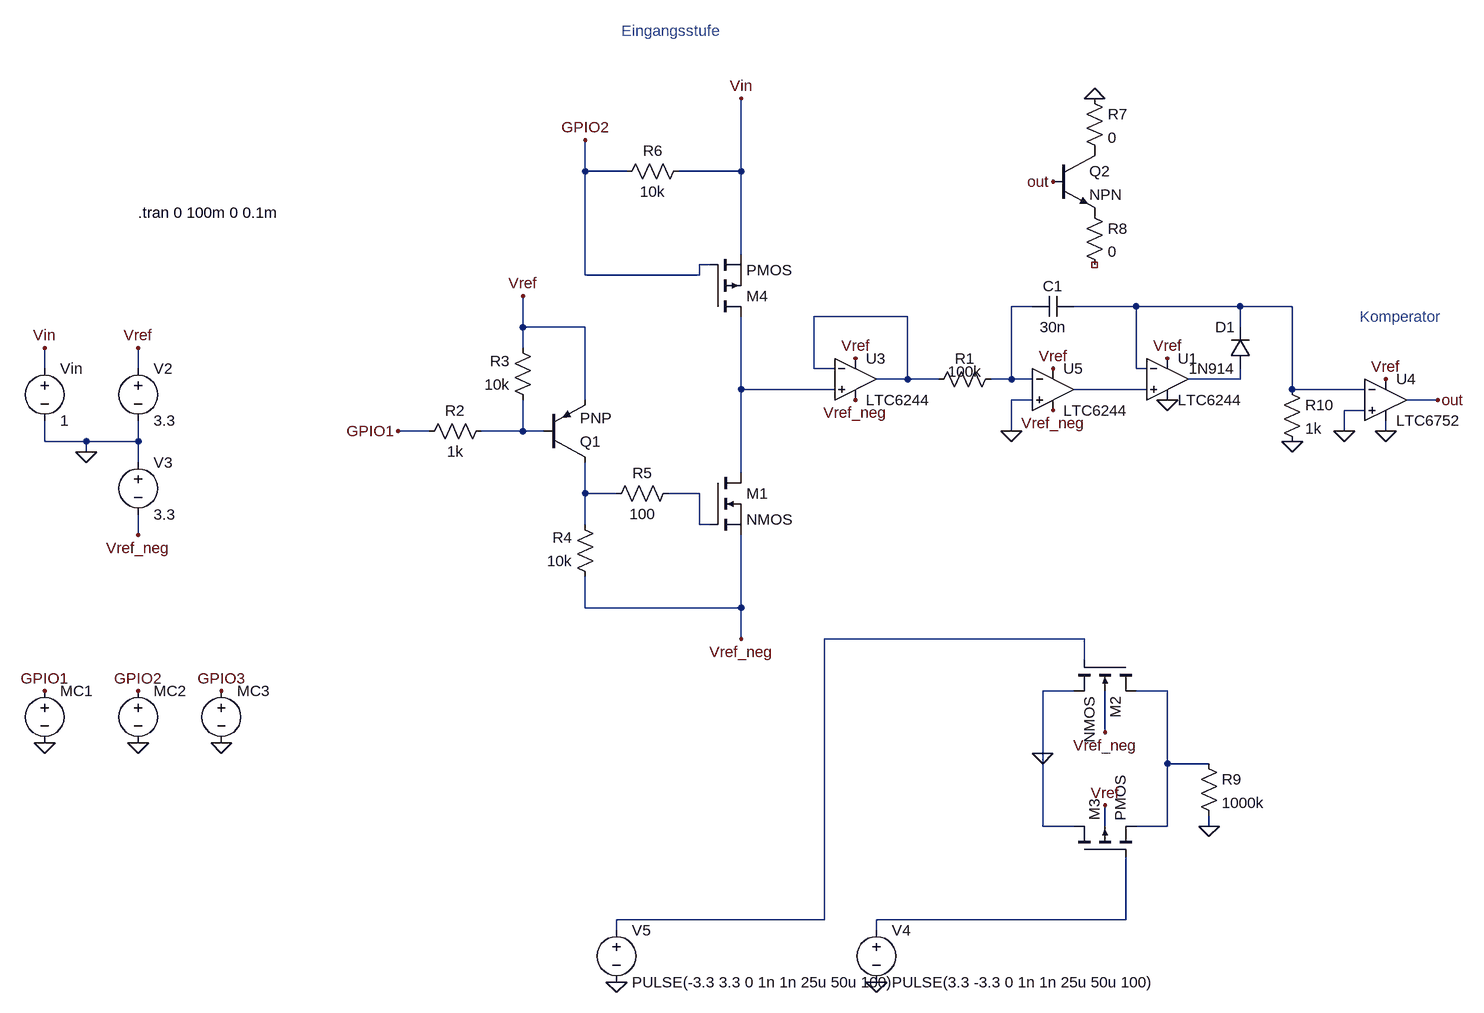
[diagram p0: schematic dual_slope_adc.asc]
dual_slope_adc.asc, the LTspice schematic file:
Version 4
SHEET 1 1108 1332
WIRE -304 -320 -304 -368
WIRE -240 -320 -304 -320
WIRE -64 -320 -64 -432
WIRE -64 -320 -160 -320
WIRE -64 -192 -64 -320
WIRE -112 -176 -128 -176
WIRE -304 -160 -304 -320
WIRE -128 -160 -128 -176
WIRE -128 -160 -304 -160
WIRE 384 -112 352 -112
WIRE 544 -112 448 -112
WIRE 704 -112 544 -112
WIRE 784 -112 704 -112
WIRE 192 -96 48 -96
WIRE -400 -80 -400 -128
WIRE -304 -80 -400 -80
WIRE 704 -80 704 -112
WIRE -400 -48 -400 -80
WIRE -1136 -16 -1136 -48
WIRE -992 -16 -992 -48
WIRE 48 -16 48 -96
WIRE 80 -16 48 -16
WIRE 544 -16 544 -112
WIRE 560 -16 544 -16
WIRE 192 0 192 -96
WIRE 192 0 144 0
WIRE 240 0 192 0
WIRE 352 0 352 -112
WIRE 352 0 320 0
WIRE 384 0 352 0
WIRE 704 0 704 -16
WIRE 704 0 624 0
WIRE -64 16 -64 -96
WIRE 80 16 -64 16
WIRE 560 16 448 16
WIRE 784 16 784 -112
WIRE 896 16 784 16
WIRE -304 32 -304 -80
WIRE 384 32 352 32
WIRE 1008 32 960 32
WIRE 896 48 864 48
WIRE -544 80 -592 80
WIRE -400 80 -400 32
WIRE -400 80 -464 80
WIRE -368 80 -400 80
WIRE 352 80 352 32
WIRE 864 80 864 48
WIRE 928 80 928 64
WIRE -1136 96 -1136 64
WIRE -1072 96 -1136 96
WIRE -992 96 -992 64
WIRE -992 96 -1072 96
WIRE -1072 112 -1072 96
WIRE -992 128 -992 96
WIRE -64 144 -64 16
WIRE -304 176 -304 128
WIRE -256 176 -304 176
WIRE -128 176 -176 176
WIRE -304 224 -304 176
WIRE -128 224 -128 176
WIRE -112 224 -128 224
WIRE -992 240 -992 208
WIRE -304 352 -304 304
WIRE -64 352 -64 240
WIRE -64 352 -304 352
WIRE -64 400 -64 352
WIRE 464 400 64 400
WIRE 464 432 464 400
WIRE 448 480 400 480
WIRE 592 480 544 480
WIRE 496 544 496 480
WIRE 400 576 400 480
WIRE 592 592 592 480
WIRE 656 592 592 592
WIRE 400 688 400 576
WIRE 448 688 400 688
WIRE 496 688 496 656
WIRE 592 688 592 592
WIRE 592 688 544 688
WIRE 656 688 656 672
WIRE 64 832 64 400
WIRE 64 832 -256 832
WIRE 528 832 528 736
WIRE 528 832 144 832
WIRE -256 848 -256 832
WIRE 144 848 144 832
FLAG -1072 112 0
FLAG 352 80 0
FLAG 864 80 0
FLAG 928 80 0
FLAG -1136 480 GPIO1
FLAG -1136 560 0
FLAG -1136 -48 Vin
FLAG -992 -48 Vref
FLAG 416 -16 Vref
FLAG 928 0 Vref
FLAG -992 240 Vref_neg
FLAG 416 48 Vref_neg
FLAG -992 480 GPIO2
FLAG -992 560 0
FLAG -64 400 Vref_neg
FLAG -592 80 GPIO1
FLAG -400 -128 Vref
FLAG 112 32 Vref_neg
FLAG 112 -32 Vref
FLAG -64 -432 Vin
FLAG -304 -368 GPIO2
FLAG -864 560 0
FLAG 1008 32 out
FLAG 480 -432 0
FLAG -864 480 GPIO3
FLAG 656 688 0
FLAG 496 656 Vref
FLAG 144 928 0
FLAG -256 928 0
FLAG 496 544 Vref_neg
FLAG 416 -304 out
FLAG 400 576 0
FLAG 592 -32 Vref
FLAG 784 96 0
FLAG 592 32 0
SYMBOL res 336 -16 R90
WINDOW 0 0 56 VBottom 2
WINDOW 3 20 56 VBottom 2
SYMATTR InstName R1
SYMATTR Value 100k
SYMBOL cap 448 -128 R90
WINDOW 0 0 32 VBottom 2
WINDOW 3 32 32 VTop 2
SYMATTR InstName C1
SYMATTR Value 30n
SYMBOL voltage -992 -32 R0
WINDOW 123 0 0 Left 0
WINDOW 39 0 0 Left 0
SYMATTR InstName V2
SYMATTR Value 3.3
SYMBOL voltage -992 112 R0
WINDOW 123 0 0 Left 0
WINDOW 39 0 0 Left 0
SYMATTR InstName V3
SYMATTR Value 3.3
SYMBOL voltage -1136 464 R0
WINDOW 123 0 0 Left 0
WINDOW 39 0 0 Left 0
WINDOW 3 24 96 Invisible 2
SYMATTR Value PULSE(3.3 0 0 1n 1n 1m 10m 100)
SYMATTR InstName MC1
SYMBOL voltage -1136 -32 R0
WINDOW 123 0 0 Left 0
WINDOW 39 0 0 Left 0
SYMATTR InstName Vin
SYMATTR Value 1
SYMBOL voltage -992 464 R0
WINDOW 123 0 0 Left 0
WINDOW 39 0 0 Left 0
WINDOW 3 24 96 Invisible 2
SYMATTR Value PULSE(3.3 0 1m 1n 1n 9m 10m 100)
SYMATTR InstName MC2
SYMBOL res -560 96 R270
WINDOW 0 32 56 VTop 2
WINDOW 3 0 56 VBottom 2
SYMATTR InstName R2
SYMATTR Value 1k
SYMBOL res -384 48 R180
WINDOW 0 36 76 Left 2
WINDOW 3 36 40 Left 2
SYMATTR InstName R3
SYMATTR Value 10k
SYMBOL res -288 320 R180
WINDOW 0 36 76 Left 2
WINDOW 3 36 40 Left 2
SYMATTR InstName R4
SYMATTR Value 10k
SYMBOL res -272 192 R270
WINDOW 0 32 56 VTop 2
WINDOW 3 0 56 VBottom 2
SYMATTR InstName R5
SYMATTR Value 100
SYMBOL pnp -368 128 M180
SYMATTR InstName Q1
SYMBOL voltage -864 464 R0
WINDOW 123 0 0 Left 0
WINDOW 39 0 0 Left 0
WINDOW 3 24 96 Invisible 2
SYMATTR Value PULSE(0 3.3 6m 1n 1n 1m 7m 1)
SYMATTR InstName MC3
SYMBOL res -256 -304 R270
WINDOW 0 32 56 VTop 2
WINDOW 3 0 56 VBottom 2
SYMATTR InstName R6
SYMATTR Value 10k
SYMBOL pmos -112 -96 M180
SYMATTR InstName M4
SYMBOL nmos -112 144 R0
SYMATTR InstName M1
SYMBOL npn 416 -352 R0
SYMATTR InstName Q2
SYMBOL res 464 -448 R0
SYMATTR InstName R7
SYMATTR Value 0
SYMBOL res 464 -272 R0
SYMATTR InstName R8
SYMATTR Value 0
SYMBOL nmos4 544 432 R90
SYMATTR InstName M2
SYMBOL pmos4 448 736 R270
SYMATTR InstName M3
SYMBOL res 640 576 R0
SYMATTR InstName R9
SYMATTR Value 1000k
SYMBOL voltage 144 832 R0
WINDOW 123 0 0 Left 0
WINDOW 39 0 0 Left 0
SYMATTR InstName V4
SYMATTR Value PULSE(3.3 -3.3 0 1n 1n 25u 50u 100)
SYMBOL voltage -256 832 R0
WINDOW 123 0 0 Left 0
WINDOW 39 0 0 Left 0
SYMATTR InstName V5
SYMATTR Value PULSE(-3.3 3.3 0 1n 1n 25u 50u 100)
SYMBOL Comparators\\LTC6752 928 -32 R0
SYMATTR InstName U4
SYMBOL OpAmps\\LTC6244 112 0 R0
SYMATTR InstName U3
SYMBOL OpAmps\\LTC6244 416 16 R0
SYMATTR InstName U5
SYMBOL OpAmps\\LTC6244 592 0 R0
SYMATTR InstName U1
SYMBOL diode 720 -16 R180
WINDOW 0 24 64 Left 2
WINDOW 3 24 0 Left 2
SYMATTR InstName D1
SYMATTR Value 1N914
SYMBOL res 768 0 R0
SYMATTR InstName R10
SYMATTR Value 1k
TEXT -992 -256 Left 2 !.tran 0 100m 0 0.1m
TEXT 888 -96 Left 2 ;Komperator
TEXT -248 -536 Left 2 ;Eingangsstufe

The netlist it stands for:
* dual_slope_adc.asc
R1 N001 N003 100k
C1 N002 N001 30n
V2 Vref 0 3.3
V3 0 Vref_neg 3.3
V§MC1 GPIO1 0 PULSE(3.3 0 0 1n 1n 1m 10m 100)
Vin Vin 0 1
V§MC2 GPIO2 0 PULSE(3.3 0 1m 1n 1n 9m 10m 100)
R2 GPIO1 N007 1k
R3 N007 Vref 10k
R4 Vref_neg N008 10k
R5 N008 N009 100
Q1 N008 N007 Vref 0 PNP
V§MC3 GPIO3 0 PULSE(0 3.3 6m 1n 1n 1m 7m 1)
R6 GPIO2 Vin 10k
M4 N005 GPIO2 Vin Vin PMOS
M1 N005 N009 Vref_neg Vref_neg NMOS
Q2 P001 out P002 0 NPN
R7 0 P001 0
R8 P002 NC_01 0
M2 N011 N010 0 Vref_neg NMOS
M3 0 N012 N011 Vref PMOS
R9 N011 0 1000k
V4 N012 0 PULSE(3.3 -3.3 0 1n 1n 25u 50u 100)
V5 N010 0 PULSE(-3.3 3.3 0 1n 1n 25u 50u 100)
XU4 0 N002 Vref 0 out LTC6752  ; pins In+ In- V+ V- OUT
XU3 N005 N003 Vref Vref_neg N003 LTC6244  ; pins In+ In- V+ V- OUT
XU5 0 N001 Vref Vref_neg N006 LTC6244  ; pins In+ In- V+ V- OUT
XU1 N006 N002 Vref 0 N004 LTC6244  ; pins In+ In- V+ V- OUT
D1 N004 N002 1N914
R10 N002 0 1k
.model D D
.lib standard.dio
.model NPN NPN
.model PNP PNP
.lib standard.bjt
.model NMOS NMOS
.model PMOS PMOS
.lib standard.mos
.tran 0 100m 0 0.1m
* Komperator
* Eingangsstufe
.lib LTC7.lib
.backanno
.end